# Altium project AGC test.PrjPcb
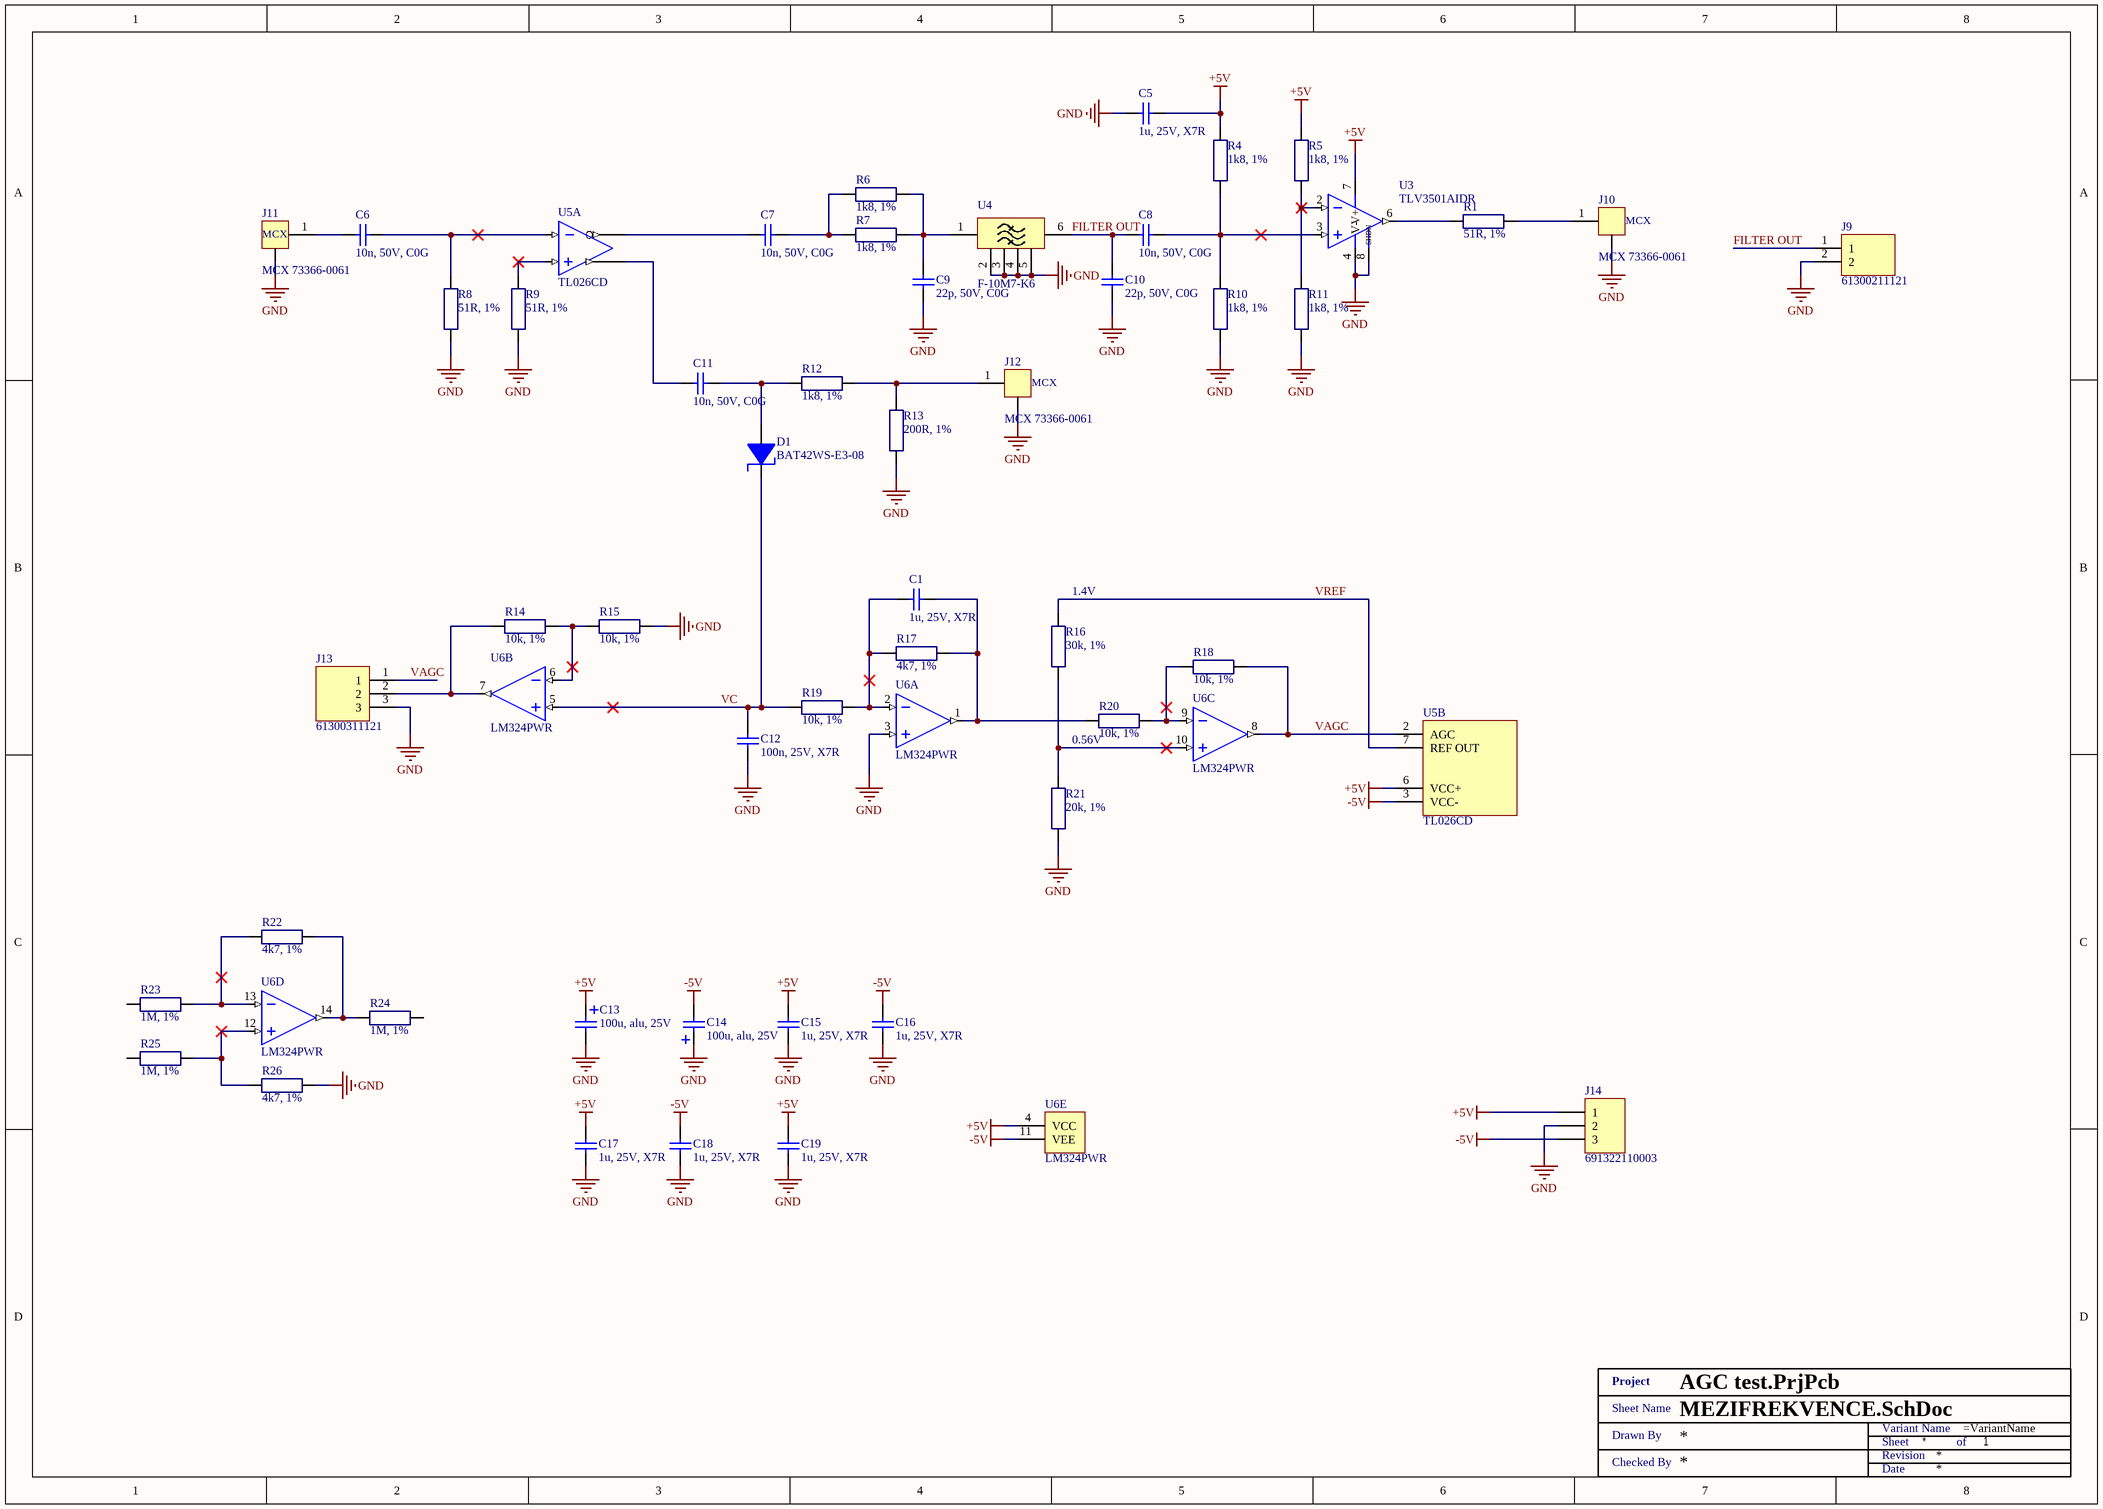
[diagram p0: MEZIFREKVENCE.SchDoc]
1 sheet, 52 parts. Net scope: global (net labels, ports and power ports of the same name join across sheets).
Board file: AGC test.PcbDoc

## Sheet MEZIFREKVENCE.SchDoc
size A3; SheetNumber: 1; SheetTotal: 1

### Parts
C1  1u, 25V, X7R  [SMD0603]
C5  1u, 25V, X7R  [SMD0603]
C6  10n, 50V, C0G  [SMD0603]
C7  10n, 50V, C0G  [SMD0603]
C8  10n, 50V, C0G  [SMD0603]
C9  22p, 50V, C0G  [SMD0603]
C10  22p, 50V, C0G  [SMD0603]
C11  10n, 50V, C0G  [SMD0603]
C12  100n, 25V, X7R  [SMD0603]
C13  100u, alu, 25V  [WCAP-ATLI_6.3x11x2.5]
C14  100u, alu, 25V  [WCAP-ATLI_6.3x11x2.5]
C15  1u, 25V, X7R  [SMD0603]
C16  1u, 25V, X7R  [SMD0603]
C17  1u, 25V, X7R  [SMD0603]
C18  1u, 25V, X7R  [SMD0603]
C19  1u, 25V, X7R  [SMD0603]
D1  BAT42WS-E3-08  [SOD-323]
J9  61300211121  [Header 2 2.54mm]
J10  MCX 73366-0061  [73366-0061]
J11  MCX 73366-0061  [73366-0061]
J12  MCX 73366-0061  [73366-0061]
J13  61300311121  [Header 3 2.54mm]
J14  691322110003  [691322110003]
R1  51R, 1%  [SMD0603 - R]
R4  1k8, 1%  [SMD0603 - R]
R5  1k8, 1%  [SMD0603 - R]
R6  1k8, 1%  [SMD0603 - R]
R7  1k8, 1%  [SMD0603 - R]
R8  51R, 1%  [SMD0603 - R]
R9  51R, 1%  [SMD0603 - R]
R10  1k8, 1%  [SMD0603 - R]
R11  1k8, 1%  [SMD0603 - R]
R12  1k8, 1%  [SMD0603 - R]
R13  200R, 1%  [SMD0603 - R]
R14  10k, 1%  [SMD0603 - R]
R15  10k, 1%  [SMD0603 - R]
R16  30k, 1%  [SMD0603 - R]
R17  4k7, 1%  [SMD0603 - R]
R18  10k, 1%  [SMD0603 - R]
R19  10k, 1%  [SMD0603 - R]
R20  10k, 1%  [SMD0603 - R]
R21  20k, 1%  [SMD0603 - R]
R22  4k7, 1%  [SMD0603 - R]
R23  1M, 1%  [SMD1206 - R]
R24  1M, 1%  [SMD1206 - R]
R25  1M, 1%  [SMD1206 - R]
R26  4k7, 1%  [SMD0603 - R]
U3  TLV3501AIDR  [SOIC08]
U4  F-10M7-K6  [F-10M7-K6]
U5  TL026CD  [SOIC08]  (parts A,B of 2)
U6  LM324PWR  [TSSOP14]  (parts A,B,C,D,E of 5)
XX?  Title 1  (value not drawn)  (graphical)

### Nets
+5V: C5.2 C13.1 C15.2 C17.2 C19.2 J14.1 R4.2 R5.2 U3.7(V+) U5.6(VCC+) U6.4(VCC)
-5V: C14.2 C16.2 C18.2 J14.3 U5.3(VCC-) U6.11(VEE)
GND: C5.1 C9.1 C10.1 C12.1 C13.2 C14.1 C15.1 C16.1 C17.1 C18.1 C19.1 J9.2 J10.2(GND) J11.2(GND) J12.2(GND) J13.3 J14.2 R8.1 R9.1 R10.1 R11.1 R13.1 R15.2 R21.1 R26.1 U3.4(V-) U3.8(SHDN) U4.2(GND) U4.3(GND) U4.4(GND) U4.5(GND) U6.3(+IN_A)
FILTER OUT: C8.1 C10.2 J9.1 U4.6(OUT)
VAGC: J13.1 R18.2 U5.2(AGC) U6.8(OUT_C)
VC: C12.2 D1.1(C) R19.1 U6.5(+IN_B)
VREF: R16.2 U5.7(REF_OUT)
NetC1_1: C1.1 R17.2 R20.1 U6.1(OUT_A)
NetC1_2: C1.2 R17.1 R19.2 U6.2(-IN_A)
NetC6_1: C6.1 J11.1(INPUT)
NetC6_2: C6.2 R8.2 U5.8(IN-)
NetC7_1: C7.1 U5.5(OUT-)
NetC7_2: C7.2 R6.2 R7.2
NetC8_2: C8.2 R4.1 R10.2 U3.3(IN+)
NetC9_2: C9.2 R6.1 R7.1 U4.1(IN)
NetC11_1: C11.1 U5.4(OUT+)
NetC11_2: C11.2 D1.2(A) R12.1
NetJ10_1: J10.1(INPUT) R1.2
NetJ12_1: J12.1(INPUT) R12.2 R13.2
NetJ13_2: J13.2 R14.1 U6.7(OUT_B)
NetR1_1: R1.1 U3.6(OUT)
NetR5_1: R5.1 R11.2 U3.2(IN-)
NetR9_2: R9.2 U5.1(IN+)
NetR14_2: R14.2 R15.1 U6.6(-IN_B)
NetR16_1: R16.1 R21.2 U6.10(+IN_C)
NetR18_1: R18.1 R20.2 U6.9(-IN_C)
NetR22_1: R22.1 R23.2 U6.13(-IN_D)
NetR22_2: R22.2 R24.1 U6.14(OUT_D)
NetR25_2: R25.2 R26.2 U6.12(+IN_D)

Not connected (* = marked no-connect by the designer): R23 1; R24 2; R25 1

### Notes on the sheet
- (near R16) 1.4V
- (near R20) 0.56V
- (in symbol Title 1) Project; Sheet Name; Variant Name; Drawn By; Sheet; of; Revision; Checked By; Date

### Library data of the parts
C1 C5 C15-C19 = CGA3E1X7R1E105K080AC: CAP CER 1UF 25V X7R 0603; Manufacturer: TDK Corporation; Tolerance: ±10%; Manufacturer Part Number: CGA3E1X7R1E105K080AC; RoHS: RoHS Compliant; Category: Capacitors; Stock 1: 109509; Pricing 1: 1=0.2, 10=0.135, 100=0.0686, 500=0.04696, 1000=0.04154 (USD); Packaging: Cut Tape (CT); Part Status: Active; Voltage - Rated: 25V; Temperature Coefficient: X7R; Operating Temperature: -55°C ~ 125°C; Features: -; Ratings: AEC-Q200; Applications: Automotive; Failure Rate: -; Mounting Type: Surface Mount, MLCC; Package / Case: 0603 (1608 Metric); Size / Dimension: 0.063" L x 0.032" W (1.60mm x 0.80mm); Height - Seated (Max): -; Thickness (Max): 0.035" (0.90mm); Lead Spacing: -; Lead Style: -; ComponentLink1URL: https://product.tdk.com/info/en/catalog/datasheets/mlcc_automotive_general_en.pdf; ComponentLink1Description: https://product.tdk.com/info/en/catalog/datasheets/mlcc_automotive_general_en.pdf; Capacitance: 1u; Supplier 1: Mouser; Supplier Part Number 1: 810-CGA3E1X7R1E105K; Supplier 2: Farnell; Supplier Part Number 2: 2346962; Supplier 3: Digi-Key; Supplier Part Number 3: 445-6931-1-ND
C6-C8 C11 = GRM1885C1H103JA01D: Multilayer Ceramic Capacitors MLCC - SMD/SMT 0603 50VDC 10000pF 5% C0G; Manufacturer: Murata Electronics; Type: Chip Multilayer Ceramic Capacitor for General Purpose; Capacitance - nF: 10 nF; Class: Class 1; CNHTS: 8532241000; Dielectric: C0G (NP0); TARIC: 8532240000; Supplier 1: Mouser; Supplier Part Number 1: 81-GRM1885C1H103JA1D; Manufacturer Part Number: GRM1885C1H103JA01D; RoHS: RoHS Compliant; Category: Multilayer Ceramic Capacitors MLCC - SMD/SMT; Stock 1: 217291; Pricing 1: 1=0.183, 10=0.129, 100=0.065, 500=0.045, 1000=0.039, 4000=0.030, 8000=0.027, 24000=0.025 (EUR); Capacitance: 10n; Height: 0.8 mm; Length: 1.6 mm; Package / Case: 0603 (1608 metric); Packaging: Cut Tape; Product: General Type MLCCs; Series: GRM; Termination Style: SMD/SMT; Tolerance: 5 %; Voltage Rating DC: 50 VDC; Width: 0.8 mm; Brand: Murata Electronics; Capacitance - pF: 10000 pF; Case Code - in: 0603; Case Code - mm: 1608; HTS Code: 8532240020; Maximum Operating Temperature: + 125 C; Minimum Operating Temperature: - 55 C; Product Type: Ceramic Capacitors; Standard Pack Qty: 4000; Subcategory: Capacitors; Termination: Standard; RoHS - Mouser: Y; Minimum Order Quantity: 1; Reeling: True; ComponentLink1URL: http://www.mouser.com/datasheet/2/281/murata_03052018_GRM_Series_1-1310166.pdf; ComponentLink1Description: http://www.mouser.com/datasheet/2/281/murata_03052018_GRM_Series_1-1310166.pdf; Supplier 2: Farnell; Supplier Part Number 2: 2456107
C9 C10 = MC0603N220J500CT: MULTICOMP - MC0603N220J500CT - CAP, MLCC, C0G/NP0, 22PF, 50V, 0603; Manufacturer: MULTICOMP; Manufacturer Part Number: MC0603N220J500CT; RoHS: YES; Stock 1: 184439; Pricing 1: 10=0.0077, 100=0.0065, 500=0.0052, 1000=0.0044, 2000=0.0038 (GBP); ComponentLink1URL: http://www.farnell.com/datasheets/1901289.pdf; ComponentLink1Description: http://www.farnell.com/datasheets/1901289.pdf; Capacitance: 22p; Supplier 1: Farnell; Supplier Part Number 1: 1759057; Supplier 2: Newark; Supplier Part Number 2: 94W8766
C12 = 06033C104KAT2A: AVX - 06033C104KAT2A - CAP, MLCC, X7R, 0.1UF, 25V, 0603; Ceramic Capacitor Case: 0603 [1608 Metric]; Voltage Rating: 25; Capacitance Tolerance: ± 10%; Dielectric Characteristic: X7; Product Range: AVX 0603 MLCC; SVHC: No SVHC (17-Dec-2015)<!--FANDB--><div class="features-and-benefits-container"><div class="features-and-benefits-desc-container"><span class="features-and-benefits-container-desc">SMD Multilayer Ceramic Capacitor, 0603 [1608 Metric], 0.1 µF, 25 V, ± 10%, X7R, AVX 0603 MLCC</span></div><div class="features-and-benefits-description"><span class="features-benefits-value">The 06033C104KAT2A is a SMD Multilayer Ceramic Capacitor with Ni/Sn-plated termination, X7R dielectric and 0603 case. X7R formulations are called temperature stable ceramics and fall into EIA class II materials. X7R is the most popular of this intermediate dielectric constant material. This capacitance change is non-linear. Capacitance for X7R varies under the influence of electrical operating conditions such as voltage and frequency. X7; Supplier 1: Farnell; Supplier Part Number 1: 2530141; Manufacturer: AVX; Manufacturer Part Number: 06033C104KAT2A; RoHS: YES; Stock 1: 22809; Pricing 1: 10=0.012, 100=0.0096, 500=0.0069, 1000=0.006, 2000=0.0048, 4000=0.0038, 20000=0.0027, 40000=0.0026 (GBP); Capacitance: 100n; Packaging: Cut Tape; Operating Temperature Min: -55; Operating Temperature Max: 125; Automotive Qualification Standard: -; MSL: MSL 1 - Unlimited; ComponentLink1URL: http://www.farnell.com/datasheets/2237835.pdf; ComponentLink1Description: http://www.farnell.com/datasheets/2237835.pdf; Supplier 2: Digi-Key; Supplier Part Number 2: 478-3714-1-ND
C13 C14 = 860010473007: CAP 100 UF 20% 25 V; Manufacturer: Wurth Electronics; Material: Aluminium; Capacitance: 100uF; Polarity: Polar; Ripple Current: 209mA; Life (Hours): 2000Hour; Supplier 1: Mouser; Supplier Part Number 1: 710-860010473007; Manufacturer Part Number: 860010473007; RoHS: Yes; Category: Aluminum Electrolytic Capacitors; Stock 1: 1494; Pricing 1: 1=0.14000, 10=0.13400, 25=0.13400, 50=0.11200, 100=0.09800, 250=0.08700 (USD); Mount: Through Hole; Case/Package: Radial; Min Operating Temperature: -40°C; Max Operating Temperature: 85°C; Tolerance: 20%; Voltage Rating (DC): 25V; Package Quantity: 1500; Packaging: Tape and Reel; Voltage Rating: 25V; Diameter: 6.3mm; Height: 11mm; Lead Pitch: 0.098inch; Height - Seated (Max): 0.492inch; REACH SVHC: Unknown; ComponentLink1URL: https://datasheet.ciiva.com/48693/001280151-da-01-en-wcap-atg8-alu-elec-caps-860010473007-48693591.pdf?src-supplier=Conrad; ComponentLink1Description: https://datasheet.ciiva.com/48693/001280151-da-01-en-wcap-atg8-alu-elec-caps-860010473007-48693591.pdf?src-supplier=Conrad; Supplier 2: Farnell; Supplier Part Number 2: 2465675; Supplier 3: Digi-Key; Supplier Part Number 3: 732-8630-1-ND
D1 = BAT42WS-E3-08: DIODE SCHOTTKY 30V 200MA SOD323; Manufacturer: Vishay Semiconductor Diodes Division; Current - Average Rectified (Io): 200mA (DC); Speed: Small Signal =< 200mA (Io), Any Speed; Capacitance @ Vr, F: 7pF @ 1V, 1MHz; Supplier 1: Digi-Key; Supplier Part Number 1: BAT42WS-E3-08-ND; Manufacturer Part Number: BAT42WS-E3-08; RoHS: RoHS Compliant; Category: Discrete Semiconductor Products; Stock 1: 0; Pricing 1: 15000=0.0504 (USD); Packaging: Tape & Reel (TR); Part Status: Active; Diode Type: Schottky; Mounting Type: Surface Mount; Package / Case: SC-76, SOD-323; Supplier Device Package: SOD-323; Operating Temperature - Junction: 125°C (Max); ComponentLink1URL: http://www.vishay.com/docs/81813/bat42wsv.pdf; ComponentLink1Description: http://www.vishay.com/docs/81813/bat42wsv.pdf; Supplier 2: Mouser; Supplier Part Number 2: 78-BAT42WS-E3-08
J9 = 61300211121: CONN HEADER 2 POS 2.54; Manufacturer: Wurth Electronics Inc.; Pitch - Mating: 0.100" (2.54mm); Number of Positions: 2; Number of Positions Loaded: All; Style: Board to Board or Cable; Shrouding: Unshrouded; Contact Length - Mating: 0.236" (6.00mm); Contact Length - Post: 0.118" (3.00mm); Overall Contact Length: 0.454" (11.54mm); Material Flammability Rating: UL94 V-0; Current Rating: 3A; Voltage Rating: 250V; Manufacturer Part Number: 61300211121; RoHS: RoHS Compliant; Category: Connectors, Interconnects; Stock 1: 164911; Pricing 1: 1=0.13, 10=0.106, 25=0.088, 50=0.074, 100=0.067, 1000=0.061 (USD); Packaging: Bulk; Part Status: Active; Connector Type: Header; Contact Type: Male Pin; Number of Rows: 1; Row Spacing - Mating: -; Mounting Type: Through Hole; Termination: Solder; Fastening Type: Push-Pull; Insulation Height: 0.100" (2.54mm); Contact Shape: Square; Contact Finish - Mating: Gold; Contact Finish Thickness - Mating: -; Contact Finish - Post: -; Contact Material: Copper Alloy; Insulation Material: Polybutylene Terephthalate (PBT); Features: -; Operating Temperature: -40°C ~ 125°C; Ingress Protection: -; Insulation Color: Black; Mated Stacking Heights: -; Contact Finish Thickness - Post: -; Applications: -; ComponentLink1URL: https://katalog.we-online.de/em/datasheet/6130xx11121.pdf; ComponentLink1Description: https://katalog.we-online.de/em/datasheet/6130xx11121.pdf; Supplier 1: Mouser; Supplier Part Number 1: 710-61300211121; Supplier 2: Farnell; Supplier Part Number 2: 2356153; Supplier 3: Digi-Key; Supplier Part Number 3: 732-5315-ND
J10-J12 = 73366-0061: CONN MCX JACK STR 50 OHM PCB; Manufacturer: Molex, LLC; Manufacturer Part Number: 0733660061; Connector Type: Jack, Female Socket; Contact Termination: Solder; Impedance: 50 Ohm; Body Material: Brass; Body Finish: Gold; Dielectric Material: Polytetrafluoroethylene (PTFE); Center Contact Material: Beryllium Copper; Mating Cycles: 500; RoHS: RoHS Compliant; Category: Connectors, Interconnects; Stock 1: 39394; Pricing 1: 1=1.95, 10=1.765, 25=1.6572, 50=1.5854, 100=1.5133, 250=1.36916, 500=1.26106, 1000=1.0809, 2500=1.00884 (USD); Packaging: Tray; Part Status: Active; Connector Style: MCX; Shield Termination: Solder; Mounting Type: Through Hole; Mounting Feature: -; Cable Group: -; Fastening Type: Snap-On; Features: -; Housing Color: Gold; Ingress Protection: -; Includes: -; Center Contact Plating: Gold; Operating Temperature: -55°C ~ 155°C; Insertion Loss: -; ComponentLink1URL: https://www.molex.com/pdm_docs/sd/733660061_sd.pdf; ComponentLink1Description: https://www.molex.com/pdm_docs/sd/733660061_sd.pdf; Supplier 1: Mouser; Supplier Part Number 1: 538-73366-0061; Supplier 2: Digi-Key; Supplier Part Number 2: WM5541-ND; Supplier 3: Farnell; Supplier Part Number 3: 1909245
J13 = 61300311121: CONN HEADER 3 POS 2.54; Manufacturer: Wurth Electronics Inc.; Pitch - Mating: 0.100" (2.54mm); Number of Positions: 3; Number of Positions Loaded: All; Style: Board to Board or Cable; Shrouding: Unshrouded; Contact Length - Mating: 0.236" (6.00mm); Contact Length - Post: 0.118" (3.00mm); Overall Contact Length: 0.454" (11.54mm); Material Flammability Rating: UL94 V-0; Current Rating: 3A; Voltage Rating: 250V; Manufacturer Part Number: 61300311121; RoHS: RoHS Compliant; Category: Connectors, Interconnects; Stock 1: 222317; Pricing 1: 1=0.13, 10=0.106, 25=0.088, 50=0.074, 100=0.067, 1000=0.061 (USD); Packaging: Bulk; Part Status: Active; Connector Type: Header; Contact Type: Male Pin; Number of Rows: 1; Row Spacing - Mating: -; Mounting Type: Through Hole; Termination: Solder; Fastening Type: Push-Pull; Insulation Height: 0.100" (2.54mm); Contact Shape: Square; Contact Finish - Mating: Gold; Contact Finish Thickness - Mating: -; Contact Finish - Post: -; Contact Material: Copper Alloy; Insulation Material: Polybutylene Terephthalate (PBT); Features: -; Operating Temperature: -40°C ~ 125°C; Ingress Protection: -; Insulation Color: Black; Mated Stacking Heights: -; Contact Finish Thickness - Post: -; Applications: -; ComponentLink1URL: https://katalog.we-online.de/em/datasheet/6130xx11121.pdf; ComponentLink1Description: https://katalog.we-online.de/em/datasheet/6130xx11121.pdf; Supplier 1: Mouser; Supplier Part Number 1: 710-61300311121; Supplier 2: Farnell; Supplier Part Number 2: 2356154; Supplier 3: Digi-Key; Supplier Part Number 3: 732-5316-ND
J14 = 691322110003: WR-TBL Serie 3221 - 3.50 mm Horizontal PCB Header, 03p; Pitch: 3.5 mm; Published Date: Jan 2017; Publisher: Wurth Elektronik; ComponentLink1Description: Manufacturer; ComponentLink1URL: http://www.we-online.de; ComponentLink2Description: Datasheet; ComponentLink2URL: http://katalog.we-online.de/em/datasheet/6913221100xx.pdf; Part Number: 691322110003; Pin Number: 03p; Supplier 1: Digi-Key; Supplier Part Number 1: 732-2770-ND; Supplier 2: Farnell; Supplier Part Number 2: 1841316
R1 R8 R9 = CRCW060351R0FKEA: RES SMD 51 OHM 1% 1/10W 0603; Manufacturer: Vishay Dale; Power (Watts): 0.1W, 1/10W; Temperature Coefficient: ±100ppm/°C; Manufacturer Part Number: CRCW060351R0FKEA; RoHS: RoHS Compliant; Category: Resistors; Stock 1: 21691; Pricing 1: 1=0.1, 10=0.042, 100=0.017, 1000=0.00764, 2500=0.00663 (USD); Packaging: Cut Tape (CT); Part Status: Active; Tolerance: ±1%; Composition: Thick Film; Features: Automotive AEC-Q200; Operating Temperature: -55°C ~ 155°C; Package / Case: 0603 (1608 Metric); Supplier Device Package: 0603; Size / Dimension: 0.063" L x 0.033" W (1.60mm x 0.85mm); Height - Seated (Max): 0.020" (0.50mm); Failure Rate: -; ComponentLink1URL: http://www.vishay.com/docs/20035/dcrcwe3.pdf; ComponentLink1Description: http://www.vishay.com/docs/20035/dcrcwe3.pdf; Resistance: 51R; Supplier 1: Mouser; Supplier Part Number 1: 71-CRCW0603-51-E3; Supplier 2: Farnell; Supplier Part Number 2: 1652889; Supplier 3: Digi-Key; Supplier Part Number 3: 541-51.0HCT-ND
R4-R7 R10-R12 = RC0603FR-071K8L: Res Thick Film 0603 1.8K Ohm 1% 0.1W(1/10W) ±100ppm/C Molded SMD Paper T/R; Manufacturer: Yageo; Voltage Rating (DC): 50V; Temperature Coefficient: 100ppm/°C; Max Power Dissipation: 100mW; Supplier 1: Mouser; Supplier Part Number 1: 603-RC0603FR-071K8L; Manufacturer Part Number: RC0603FR-071K8L; RoHS: Yes; Category: Chip SMD Resistors; Stock 1: 505177; Pricing 1: 1=0,10000, 10=0,01800, 100=0,00600, 1000=0,00500, 5000=0,00300, 10000=0,00300 (USD); Case/Package: 0603; Number of Pins: 2; Case Code (Metric): 1608; Case Code (Imperial): 0603; Min Operating Temperature: -55°C; Max Operating Temperature: 155°C; Resistance: 1k8; Tolerance: 1%; Composition: Thick Film; Packaging: Tape and Reel; Features: Moisture Resistant; Power Rating: 100mW; Voltage Rating: 50V; Number of Terminations: 2; Package Quantity: 5000; Termination: SMD/SMT; Military Standard: Not; Length: 1.6mm; Height: 0.45mm; Width: 0.8mm; Depth: 0.8mm; Lead Free: Lead Free; REACH SVHC: No SVHC; ComponentLink1URL: https://datasheet.ciiva.com/11808/0900766b80f96399-11808105.pdf?src-supplier=RSComponents; ComponentLink1Description: https://datasheet.ciiva.com/11808/0900766b80f96399-11808105.pdf?src-supplier=RSComponents; ComponentLink2URL: https://datasheet.ciiva.com/2519/pyu-r-int-thick-7-2519189.pdf?src-supplier=Digi-Key; ComponentLink2Description: https://datasheet.ciiva.com/2519/pyu-r-int-thick-7-2519189.pdf?src-supplier=Digi-Key; ComponentLink3URL: https://datasheet.ciiva.com/7746/443971-7746277.pdf?src-supplier=Element14; ComponentLink3Description: https://datasheet.ciiva.com/7746/443971-7746277.pdf?src-supplier=Element14; ComponentLink4URL: https://datasheet.ciiva.com/2519/pyu-r-int-thick-7-2519190.pdf?src-supplier=Digi-Key; ComponentLink4Description: https://datasheet.ciiva.com/2519/pyu-r-int-thick-7-2519190.pdf?src-supplier=Digi-Key; ComponentLink5URL: https://datasheet.ciiva.com/7746/443971-7746278.pdf?src-supplier=Element14; ComponentLink5Description: https://datasheet.ciiva.com/7746/443971-7746278.pdf?src-supplier=Element14; ComponentLink6URL: https://datasheet.ciiva.com/12558/rc0603-272842-12558694.pdf?src-supplier=Mouser; ComponentLink6Description: https://datasheet.ciiva.com/12558/rc0603-272842-12558694.pdf?src-supplier=Mouser; ComponentLink7URL: https://datasheet.ciiva.com/2519/pyu-r-int-thick-7-2519191.pdf?src-supplier=Digi-Key; ComponentLink7Description: https://datasheet.ciiva.com/2519/pyu-r-int-thick-7-2519191.pdf?src-supplier=Digi-Key; Supplier 2: Digi-Key; Supplier Part Number 2: 311-1.80KHRCT-ND; Supplier 3: Farnell; Supplier Part Number 3: 2693664
R13 = RC0603FR-13200RL: Res Thick Film 0603 200 Ohm 1% 0.1W(1/10W) ±100ppm/C Molded SMD Paper T/R; Manufacturer: Yageo; Temperature Coefficient: 100ppm/°C; Power Rating: 100mW; Voltage Rating: 50V; Supplier 1: Mouser; Supplier Part Number 1: 603-RC0603FR-13200RL; Manufacturer Part Number: RC0603FR-13200RL; RoHS: Yes; Category: Chip SMD Resistors; Stock 1: 45325; Pricing 1: 1=0,10000, 10=0,01800, 50=0,01800, 100=0,00600, 1000=0,00500, 10000=0,00400 (USD); Case/Package: 0603; Contact Plating: Tin,Matte; Case Code (Imperial): 0603; Case Code (Metric): 1608; Min Operating Temperature: -55°C; Max Operating Temperature: 155°C; Resistance: 200R; Tolerance: 1%; Resistor Type: Thick Film; Packaging: Tape and Reel; Termination: SMD/SMT; Series: RC; Construction: Rectangular; Length: 1.6mm; Width: 0.8mm; Height: 0.45mm; Depth: 0.8mm; Radiation Hardening: No; Military Standard: Not; RoHS Compliant: Yes; ComponentLink1URL: https://datasheet.ciiva.com/12562/rc0603-272842-12562026.pdf?src-supplier=Mouser; ComponentLink1Description: https://datasheet.ciiva.com/12562/rc0603-272842-12562026.pdf?src-supplier=Mouser; Supplier 2: Arrow Electronics; Supplier Part Number 2: RC0603FR-13200RL
R14 R15 R18-R20 = RC0603FR-0710KL: YAGEO (PHYCOMP) - RC0603FR-0710KL - RES, THICK FILM, 10K, 1%, 0.1W, 0603; Voltage Rating: 50; Resistor Case Style: 0603 [1608 Metric]; Power Rating: 100; Product Range: RC Series; Temperature Coefficient: ± 100; SVHC: No SVHC (20-Jun-2016); Manufacturer: YAGEO (PHYCOMP); Manufacturer Part Number: RC0603FR-0710KL; RoHS: YES; Stock 1: 9995; Pricing 1: 5000=0.0025, 25000=0.0014, 50000=0.0013 (GBP); Resistance: 10k; Resistance Tolerance: ± 1%; Packaging: Tape & Reel; Resistor Element Material: Thick Film; Automotive Qualification Standard: -; MSL: MSL 1 - Unlimited<!--FANDB--><div class="features-and-benefits-container"><div class="features-and-benefits-desc-container"><span class="features-and-benefits-container-desc">SMD Chip Resistor, Thick Film, 10 kohm, 50 V, 0603 [1608 Metric], 100 mW, ± 1; ComponentLink1URL: http://past.yageo.com/pdf/PYu-R_Packing_6.pdf; ComponentLink1Description: http://past.yageo.com/pdf/PYu-R_Packing_6.pdf; ComponentLink2URL: http://www.farnell.com/datasheets/2167052.pdf; ComponentLink2Description: http://www.farnell.com/datasheets/2167052.pdf; Supplier 1: Mouser; Supplier Part Number 1: 603-RC0603FR-0710KL; Supplier 2: Farnell; Supplier Part Number 2: 2421850; Supplier 3: Digi-Key; Supplier Part Number 3: 311-10.0KHRCT-ND
R16 = RC0603FR-0730KL: YAGEO - RC0603FR-0730KL - RES, THICK FILM, 30K, 1%, 0.1W, 0603, REEL; Power Rating: 100mW; Temperature Coefficient: 100ppm/°C; Voltage Rating (DC): 50V; Supplier 1: Mouser; Supplier Part Number 1: 603-RC0603FR-0730KL; Manufacturer: Yageo; Manufacturer Part Number: RC0603FR-0730KL; RoHS: Yes; Category: Chip SMD Resistors; Stock 1: 345417; Pricing 1: 1=0.10000, 10=0.01800, 50=0.01800, 100=0.00600, 1000=0.00500, 10000=0.00300 (USD); Case/Package: 0603; Number of Pins: 2; Case Code (Imperial): 0603; Case Code (Metric): 1608; Size Code: 0603; Min Operating Temperature: -55°C; Max Operating Temperature: 155°C; Resistance: 30k; Tolerance: 1%; Packaging: Tape and Reel; Number of Terminations: 2; Voltage Rating: 50V; Package Quantity: 5000; Termination: SMD/SMT; Resistor Type: Thick Film; Features: Moisture Resistant; Series: RC; Max Power Dissipation: 100mW; Construction: Rectangular; Resistance Tolerance: 1%; Length: 1.6mm; Width: 0.8mm; Height: 0.45mm; Depth: 0.8mm; Lead Free: Lead Free; REACH SVHC: Unknown; Military Standard: Not; RoHS Compliant: Yes; ComponentLink1URL: https://datasheet.ciiva.com/12558/rc0603-272842-12558744.pdf?src-supplier=Mouser; ComponentLink1Description: https://datasheet.ciiva.com/12558/rc0603-272842-12558744.pdf?src-supplier=Mouser; ComponentLink2URL: https://datasheet.ciiva.com/46395/443971-46395003.pdf?src-supplier=Element14; ComponentLink2Description: https://datasheet.ciiva.com/46395/443971-46395003.pdf?src-supplier=Element14; Supplier 2: Farnell; Supplier Part Number 2: 3495811; Supplier 3: Digi-Key; Supplier Part Number 3: 311-30.0KHRCT-ND
R17 R22 R26 = AC0603FR-074K7L: RES SMD 4.7K OHM 1% 1/10W 0603; Manufacturer: Yageo; Power (Watts): 0.1W, 1/10W; Temperature Coefficient: ±100ppm/°C; Manufacturer Part Number: AC0603FR-074K7L; RoHS: RoHS Compliant; Category: Resistors; Stock 1: 391581; Pricing 1: 1=0.1, 10=0.025, 100=0.01, 1000=0.00448, 2500=0.00389 (USD); Packaging: Cut Tape (CT); Part Status: Active; Tolerance: ±1%; Composition: Thick Film; Features: Automotive AEC-Q200, Moisture Resistant; Operating Temperature: -55°C ~ 155°C; Package / Case: 0603 (1608 Metric); Supplier Device Package: 0603; Size / Dimension: 0.063" L x 0.032" W (1.60mm x 0.80mm); Height - Seated (Max): 0.022" (0.55mm); Failure Rate: -; ComponentLink1URL: http://www.yageo.com/NewPortal/yageodocoutput?fileName=/pdf/R-Chip/PYu-AC_51_RoHS_L_6.pdf; ComponentLink1Description: http://www.yageo.com/NewPortal/yageodocoutput?fileName=/pdf/R-Chip/PYu-AC_51_RoHS_L_6.pdf; Resistance: 4k7; Supplier 1: Mouser; Supplier Part Number 1: 603-AC0603FR-074K7L; Supplier 2: Digi-Key; Supplier Part Number 2: YAG3613CT-ND; Supplier 3: Future Electronics; Supplier Part Number 3: AC0603FR-074K7L-CUTT
R21 = AC0603FR-0720KL: RES SMD 20K OHM 1% 1/10W 0603; Manufacturer: Yageo; Power (Watts): 0.1W, 1/10W; Temperature Coefficient: ±100ppm/°C; Manufacturer Part Number: AC0603FR-0720KL; RoHS: RoHS Compliant; Category: Resistors; Stock 1: 120000; Pricing 1: 1=0.1, 10=0.025, 100=0.01, 1000=0.00448, 2500=0.00389 (USD); Packaging: Cut Tape (CT); Part Status: Active; Tolerance: ±1%; Composition: Thick Film; Features: Automotive AEC-Q200, Moisture Resistant; Operating Temperature: -55°C ~ 155°C; Package / Case: 0603 (1608 Metric); Supplier Device Package: 0603; Size / Dimension: 0.063" L x 0.032" W (1.60mm x 0.80mm); Height - Seated (Max): 0.022" (0.55mm); Failure Rate: -; ComponentLink1URL: http://www.yageo.com/NewPortal/yageodocoutput?fileName=/pdf/R-Chip/PYu-AC_51_RoHS_L_6.pdf; ComponentLink1Description: http://www.yageo.com/NewPortal/yageodocoutput?fileName=/pdf/R-Chip/PYu-AC_51_RoHS_L_6.pdf; Resistance: 20k; Supplier 1: Mouser; Supplier Part Number 1: 603-AC0603FR-0720KL; Supplier 2: Digi-Key; Supplier Part Number 2: YAG3577CT-ND
R23-R25 = ERJ-8ENF1004V: RES SMD 1M OHM 1% 1/4W 1206; Manufacturer: Panasonic Electronic Components; Power (Watts): 0.25W, 1/4W; Temperature Coefficient: ±100ppm/°C; Manufacturer Part Number: ERJ-8ENF1004V; RoHS: RoHS Compliant; Category: Resistors; Stock 1: 216046; Pricing 1: 1=0.11, 10=0.097, 100=0.0373, 1000=0.01641, 2500=0.01417 (USD); Packaging: Cut Tape (CT); Part Status: Active; Tolerance: ±1%; Composition: Thick Film; Features: Automotive AEC-Q200; Operating Temperature: -55°C ~ 155°C; Package / Case: 1206 (3216 Metric); Supplier Device Package: 1206; Size / Dimension: 0.126" L x 0.063" W (3.20mm x 1.60mm); Height - Seated (Max): 0.028" (0.70mm); Failure Rate: -; ComponentLink1URL: https://industrial.panasonic.com/cdbs/www-data/pdf/RDA0000/AOA0000C304.pdf; ComponentLink1Description: https://industrial.panasonic.com/cdbs/www-data/pdf/RDA0000/AOA0000C304.pdf; Resistance: 1M; Supplier 1: Mouser; Supplier Part Number 1: 667-ERJ-8ENF1004V; Supplier 2: Farnell; Supplier Part Number 2: 2307298; Supplier 3: Digi-Key; Supplier Part Number 3: P1.00MFCT-ND
U3 = TLV3501AIDR: Rail-to-Rail, High-Speed Comparator in Microsize Packages; Manufacturer: Texas Instruments; Number of Elements: 1; Propagation Delay: 10ns; Max Supply Voltage: 5.5V; Min Supply Voltage: 2.7V; Common Mode Rejection Ratio: 70dB; Nominal Supply Current: 5mA; Input Offset Voltage (Vos): 6.5mV; Input Bias Current: 10pA; Hysteresis: 6mV; Power Supply Rejection Ratio (PSRR): 100dB; Response Time: 0.0045us; Output Current: 74mA; Output Type: TTL,PUSH-PULL; Supplier 1: Mouser; Supplier Part Number 1: 595-TLV3501AIDR; Manufacturer Part Number: TLV3501AIDR; RoHS: Yes; Category: Amplifiers - Op Amps, Buffer, Instrumentation; Stock 1: 2140; Pricing 1: 1=3.15000, 10=2.83000, 50=2.68000, 100=2.32000, 1000=1.73000, 10000=1.72000 (USD); Mount: Surface Mount; Case/Package: SOIC; Number of Pins: 8; Weight: 0.002677oz; Min Operating Temperature: -40°C; Max Operating Temperature: 125°C; Package Quantity: 2500; Packaging: Tape and Reel; Quiescent Current: 5mA; Max Supply Current: 5mA; Number of Channels: 1; Type: General Purpose; Series: -; Supply Current: 5mA; Technology: CMOS; Max Input Current: 10pA; Radiation Hardening: No; Lead Free: Lead Free; RoHS Compliant: Yes; ComponentLink1URL: https://datasheet.ciiva.com/1830/tlv3501-1830016.pdf?src-supplier=Digi-Key; ComponentLink1Description: https://datasheet.ciiva.com/1830/tlv3501-1830016.pdf?src-supplier=Digi-Key; ComponentLink2URL: https://datasheet.ciiva.com/14392/tlv3501-14392108.pdf?src-supplier=Avnet; ComponentLink2Description: https://datasheet.ciiva.com/14392/tlv3501-14392108.pdf?src-supplier=Avnet; Supplier 2: Digi-Key; Supplier Part Number 2: 296-43611-1-ND; Supplier 3: Arrow Electronics; Supplier Part Number 3: TLV3501AIDR
U4 = F-10M7-K6: 10.7 MHz crystal band-pass filter, 8 poles / - Bandwidth (-3dB): 12 KHz / - Selectivity: 90 dB / - Impedance: 900 Ω / - Dimensions: 38 x 18 mm, h 12 mm
U5 = TL026CD: Differential High-Frequency Amplifier with AGC 8-SOIC 0 to 70; Manufacturer: Texas Instruments; Common Mode Rejection Ratio: 60dB; Max Power Dissipation: 725mW; -3db Bandwidth: 50MHz; Nominal Supply Current: 27mA; Max Dual Supply Voltage: 8V; Min Dual Supply Voltage: 3V; Dual Supply Voltage: 6V; Voltage Gain: 38.59dB; Number of Channels: 1; Input Bias Current: 30uA; Operating Supply Current: 22mA; Output Current per Channel: 4mA; Operating Supply Voltage: 16V; Supplier 1: Mouser; Supplier Part Number 1: 595-TL026CD; Manufacturer Part Number: TL026CD; RoHS: Yes; Category: Amplifiers - Op Amps, Buffer, Instrumentation; Stock 1: 1672; Pricing 1: 1=2.57000, 10=2.46000, 50=2.46000, 100=2.45000, 1000=2.45000, 10000=1.45000 (USD); Case/Package: D; Number of Pins: 8; Weight: 0.002561oz; Min Operating Temperature: 0°C; Max Operating Temperature: 70°C; Packaging: Rail/Tube; Package Quantity: 75; Bandwidth: 50MHz; Number of Circuits: 1; Supply Current: 27mA; Series: TL026; Max Supply Voltage: 8V; Min Supply Voltage: 3V; Number of Elements: 1; Power Dissipation: 725mW; Number of Amplifiers: 1; Technology: JFET; Length: 4.9mm; Width: 3.91mm; Height: 1.58mm; Radiation Hardening: No; Lead Free: Lead Free; RoHS Compliant: Yes; REACH SVHC: No SVHC; ComponentLink1URL: https://datasheet.ciiva.com/26857/tl026cd-26857756.pdf?src-supplier=IIIC; ComponentLink1Description: https://datasheet.ciiva.com/26857/tl026cd-26857756.pdf?src-supplier=IIIC; ComponentLink2URL: https://datasheet.ciiva.com/28430/slfs007a-28430037.pdf?src-supplier=Avnet+Europe; ComponentLink2Description: https://datasheet.ciiva.com/28430/slfs007a-28430037.pdf?src-supplier=Avnet+Europe; ComponentLink3URL: https://datasheet.ciiva.com/26815/getdatasheetpartid-48553-26815191.pdf?src-supplier=Verical; ComponentLink3Description: https://datasheet.ciiva.com/26815/getdatasheetpartid-48553-26815191.pdf?src-supplier=Verical; ComponentLink4URL: https://datasheet.ciiva.com/1488/1835114-1488075.pdf?src-supplier=Element14; ComponentLink4Description: https://datasheet.ciiva.com/1488/1835114-1488075.pdf?src-supplier=Element14; ComponentLink5URL: https://datasheet.ciiva.com/1824/tl026-1824398.pdf?src-supplier=Digi-Key; ComponentLink5Description: https://datasheet.ciiva.com/1824/tl026-1824398.pdf?src-supplier=Digi-Key; ComponentLink6URL: https://datasheet.ciiva.com/48712/001011461-da-01-en-agc-video-amplifier-tl026cd-soic-8-tid-48712348.pdf?src-supplier=Conrad; ComponentLink6Description: https://datasheet.ciiva.com/48712/001011461-da-01-en-agc-video-amplifier-tl026cd-soic-8-tid-48712348.pdf?src-supplier=Conrad; Supplier 2: Farnell; Supplier Part Number 2: 1459444; Supplier 3: Digi-Key; Supplier Part Number 3: 296-11818-5-ND
U6 = LM324PWR: OP-AMP, 1.2MHZ, 0.5V/ US, TSSOP-14; Manufacturer: TEXAS INSTRUMENTS; Bandwidth: 1.2; No. of Amplifiers: 4; Slew Rate: 0.5; Supply Voltage Range: ± 1.5V to ± 16; Amplifier Case Style: TSSOP; No. of Pins: 14; SVHC: No SVHC (17-Dec-2014); Filter Terminals: SMD; Input Bias Current: 250000; Op Amp Type: High Gain; Output Current: 20; Quiescent Current: 0.3; Supply Voltage Max: 32; Supply Voltage Min: 3; Manufacturer Part Number: LM324PWR; RoHS: YES; Stock 1: 1889; Pricing 1: 5=0,171, 50=0,15, 250=0,126, 500=0,125, 1000=0,125 (EUR); Operating Temperature Min: 0; Operating Temperature Max: 70; Packaging: Cut Tape; MSL: MSL 1 - Unlimited; Amplifer Supply Voltage: ± 1.5V to ± 16; Operating Temperature Range: 0°C to +70; ComponentLink1URL: http://www.farnell.com/datasheets/1877076.pdf; ComponentLink1Description: http://www.farnell.com/datasheets/1877076.pdf; Stock 3: 1204; Pricing 3: 1=0,24, 10=0,23, 100=0,23, 250=0,22, 500=0,21, 1000=0,21, 3000=0,171, 10000=0,157 (EUR); ComponentLink2URL: http://www.farnell.com/datasheets/378369.pdf; ComponentLink2Description: http://www.farnell.com/datasheets/378369.pdf; Supplier 1: Mouser; Supplier 2: Farnell; Supplier Part Number 2: 2342289; Supplier Part Number 1: 595-LM324PWR

## Assembly variants
Normalni zapojeni: not fitted C1